# Altium schematic sheet Connectors.SchDoc
size A4; SheetNumber: 10; SheetTotal: 11
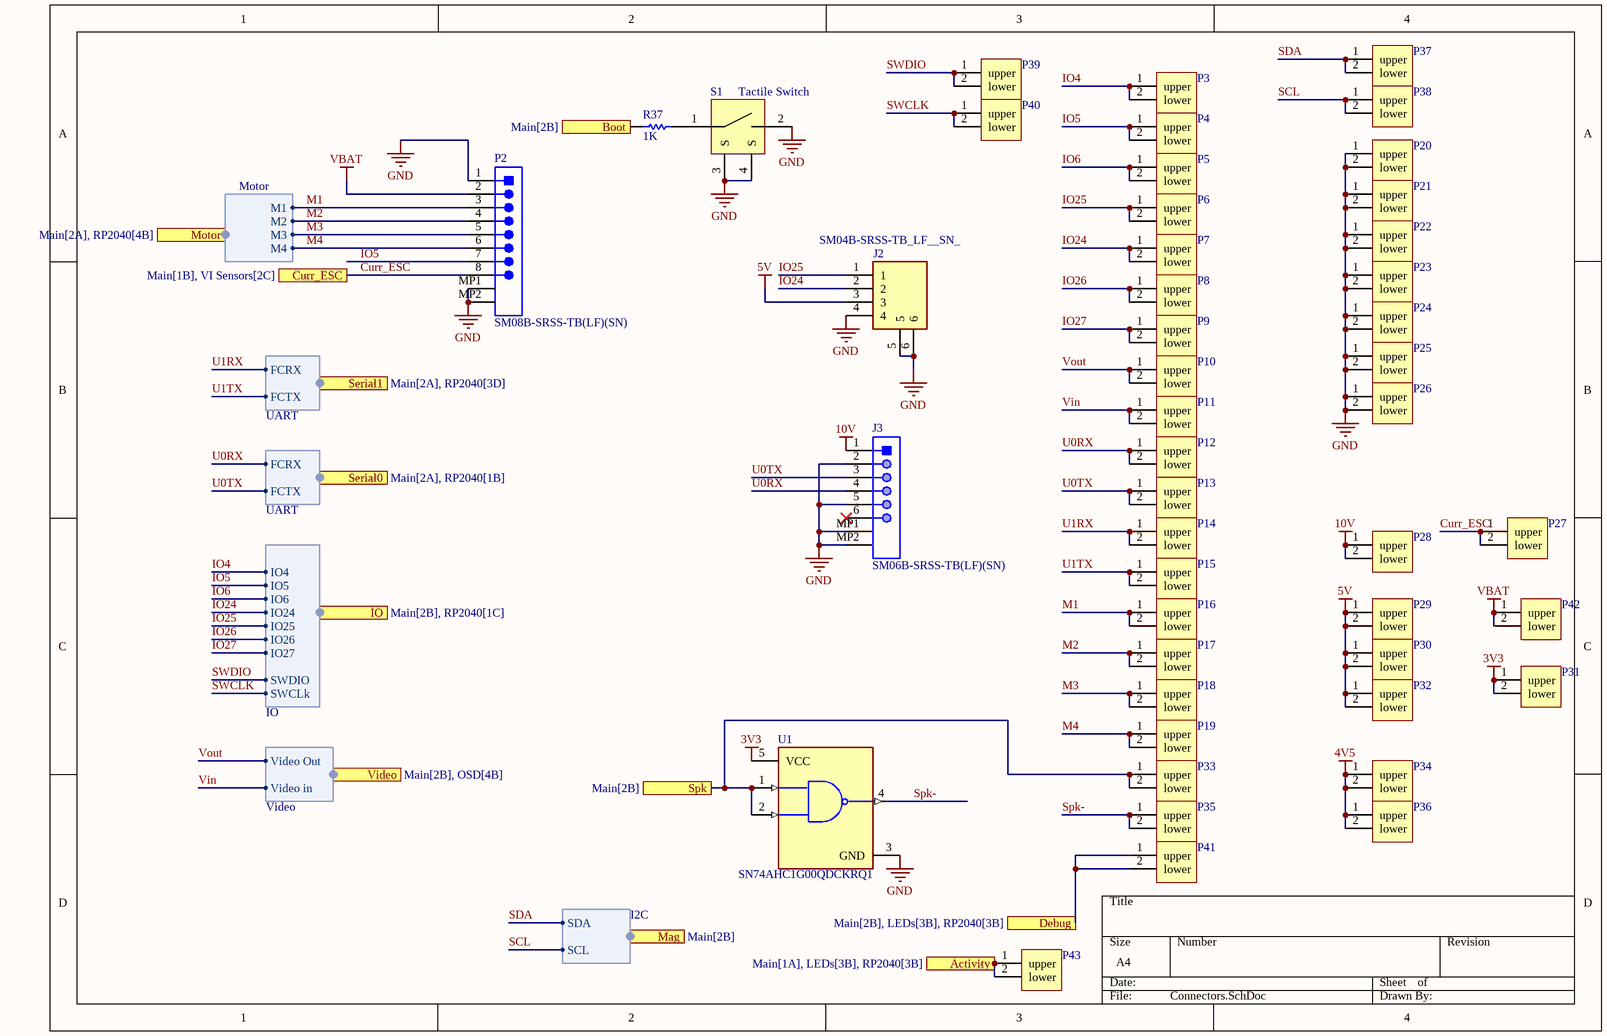
[diagram p0: Connectors.SchDoc]

## Parts
J2  SM04B-SRSS-TB_LF__SN_  [SM04B-SRSS-TB(LFSN)]
J3  SM06B-SRSS-TB(LF)(SN)  [JST-SM06B-SRSS-TB_V]
P2  SM08B-SRSS-TB(LF)(SN)  [JST-SM08B-SRSS-TB_V]
P3  solder pad rounded double sided  [solder pad double sided rounded - duplicate]  (value not drawn)
P4  solder pad rounded double sided  [solder pad double sided rounded - duplicate]  (value not drawn)
P5  solder pad rounded double sided  [solder pad double sided rounded - duplicate]  (value not drawn)
P6  solder pad rounded double sided  [solder pad double sided rounded - duplicate]  (value not drawn)
P7  solder pad rounded double sided  [solder pad double sided rounded - duplicate]  (value not drawn)
P8  solder pad rounded double sided  [solder pad double sided rounded - duplicate]  (value not drawn)
P9  solder pad rounded double sided  [solder pad double sided rounded - duplicate]  (value not drawn)
P10  solder pad rounded double sided  [solder pad double sided rounded - duplicate]  (value not drawn)
P11  solder pad rounded double sided  [solder pad double sided rounded - duplicate]  (value not drawn)
P12  solder pad rounded double sided  [solder pad double sided rounded - duplicate]  (value not drawn)
P13  solder pad rounded double sided  [solder pad double sided rounded - duplicate]  (value not drawn)
P14  solder pad rounded double sided  [solder pad double sided rounded - duplicate]  (value not drawn)
P15  solder pad rounded double sided  [solder pad double sided rounded - duplicate]  (value not drawn)
P16  solder pad rounded double sided  [solder pad double sided rounded - duplicate]  (value not drawn)
P17  solder pad rounded double sided  [solder pad double sided rounded - duplicate]  (value not drawn)
P18  solder pad rounded double sided  [solder pad double sided rounded - duplicate]  (value not drawn)
P19  solder pad rounded double sided  [solder pad double sided rounded - duplicate]  (value not drawn)
P20  solder pad square double sided  [solder pad double sided square]  (value not drawn)
P21  solder pad square double sided  [solder pad double sided square]  (value not drawn)
P22  solder pad square double sided  [solder pad double sided square]  (value not drawn)
P23  solder pad square double sided  [solder pad double sided square]  (value not drawn)
P24  solder pad square double sided  [solder pad double sided square]  (value not drawn)
P25  solder pad square double sided  [solder pad double sided square]  (value not drawn)
P26  solder pad square double sided  [solder pad double sided square]  (value not drawn)
P27  solder pad chamfered double sided  [solder pad double sided chamfered]  (value not drawn)
P28  solder pad chamfered double sided  [solder pad double sided chamfered]  (value not drawn)
P29  solder pad chamfered double sided  [solder pad double sided chamfered]  (value not drawn)
P30  solder pad chamfered double sided  [solder pad double sided chamfered]  (value not drawn)
P31  solder pad chamfered double sided  [solder pad double sided chamfered]  (value not drawn)
P32  solder pad chamfered double sided  [solder pad double sided chamfered]  (value not drawn)
P33  solder pad rounded double sided  [solder pad double sided rounded - duplicate]  (value not drawn)
P34  solder pad chamfered double sided  [solder pad double sided chamfered]  (value not drawn)
P35  solder pad rounded double sided  [solder pad double sided rounded - duplicate]  (value not drawn)
P36  solder pad chamfered double sided  [solder pad double sided chamfered]  (value not drawn)
P37  solder pad rounded double sided  [solder pad double sided rounded - duplicate]  (value not drawn)
P38  solder pad rounded double sided  [solder pad double sided rounded - duplicate]  (value not drawn)
P39  solder pad rounded double sided  [solder pad double sided rounded - duplicate]  (value not drawn)
P40  solder pad rounded double sided  [solder pad double sided rounded - duplicate]  (value not drawn)
P41  solder pad rounded double sided  [solder pad double sided rounded - duplicate]  (value not drawn)
P42  solder pad chamfered double sided  [solder pad double sided chamfered]  (value not drawn)
P43  solder pad rounded double sided  [solder pad double sided rounded - duplicate]  (value not drawn)
R37  1K  [RESC0603(1608)_N]
S1  Tactile Switch  [Tactile Switch]
U1  SN74AHC1G00QDCKRQ1  [FP-DCK0005A-IPC_A]

## Ports
Activity (see Main[1A], LEDs[3B], RP2040[3B]), Boot (see Main[2B]), Curr_ESC (see Main[1B], VI Sensors[2C]), Debug (see Main[2B], LEDs[3B], RP2040[3B]), IO (harness IO, see Main[2B], RP2040[1C]), Mag (harness I2C, see Main[2B]), Motor (harness Motor, see Main[2A], RP2040[4B]), Serial0 (harness UART, see Main[2A], RP2040[1B]), Serial1 (harness UART, see Main[2A], RP2040[3D]), Spk (see Main[2B]), Video (harness Video, see Main[2B], OSD[4B])

## Harnesses
Motor: M1, M2, M3, M4
UART: FCRX, FCTX
IO: IO4, IO5, IO6, IO24, IO25, IO26, IO27, SWDIO, SWCLk
Video: Video Out, Video in
I2C: SDA, SCL

## Nets
3V3: P31.1(upper) P31.2(lower) U1.5(VCC)
4V5: P34.1(upper) P34.2(lower) P36.1(upper) P36.2(lower)
5V: J2.3 P29.1(upper) P29.2(lower) P30.1(upper) P30.2(lower) P32.1(upper) P32.2(lower)
10V: J3.1 P28.1(upper) P28.2(lower)
GND: J2.4 J2.5 J2.6 J3.2 J3.5 J3.MP1 J3.MP2 P2.1 P2.MP1 P2.MP2 P20.1(upper) P20.2(lower) P21.1(upper) P21.2(lower) P22.1(upper) P22.2(lower) P23.1(upper) P23.2(lower) P24.1(upper) P24.2(lower) P25.1(upper) P25.2(lower) P26.1(upper) P26.2(lower) S1.2 S1.3(S) S1.4(S) U1.3(GND)
VBAT: P2.2 P42.1(upper) P42.2(lower)
Activity: P43.1(upper) P43.2(lower) ; port Activity
Boot: R37.1 ; port Boot
Curr_ESC: P2.8 P27.1(upper) P27.2(lower) ; port Curr_ESC
Debug: P41.1(upper) P41.2(lower) ; port Debug
IO4: P3.1(upper) P3.2(lower) ; port IO.IO4
IO5: P2.7 P4.1(upper) P4.2(lower) ; port IO.IO5
IO6: P5.1(upper) P5.2(lower) ; port IO.IO6
IO24: J2.2 P7.1(upper) P7.2(lower) ; port IO.IO24
IO25: J2.1 P6.1(upper) P6.2(lower) ; port IO.IO25
IO26: P8.1(upper) P8.2(lower) ; port IO.IO26
IO27: P9.1(upper) P9.2(lower) ; port IO.IO27
M1: P2.3 P16.1(upper) P16.2(lower) ; port Motor.M1
M2: P2.4 P17.1(upper) P17.2(lower) ; port Motor.M2
M3: P2.5 P18.1(upper) P18.2(lower) ; port Motor.M3
M4: P2.6 P19.1(upper) P19.2(lower) ; port Motor.M4
SCL: P38.1(upper) P38.2(lower) ; port Mag.SCL
SDA: P37.1(upper) P37.2(lower) ; port Mag.SDA
Spk: P33.1(upper) P33.2(lower) U1.1(A) U1.2(B) ; port Spk
Spk-: P35.1(upper) P35.2(lower) U1.4(Y)
SWCLK: P40.1(upper) P40.2(lower) ; port IO.SWCLk
SWDIO: P39.1(upper) P39.2(lower) ; port IO.SWDIO
U0RX: J3.4 P12.1(upper) P12.2(lower) ; port Serial0.FCRX
U0TX: J3.3 P13.1(upper) P13.2(lower) ; port Serial0.FCTX
U1RX: P14.1(upper) P14.2(lower) ; port Serial1.FCRX
U1TX: P15.1(upper) P15.2(lower) ; port Serial1.FCTX
Vin: P11.1(upper) P11.2(lower) ; port Video.Video in
Vout: P10.1(upper) P10.2(lower) ; port Video.Video Out
NetR37_2: R37.2 S1.1

Not connected (* = marked no-connect by the designer): J3 6*

## Library data of the parts
J2 = SM04B-SRSS-TB_LF__SN_: Connector; Manufacturer_Name: JST (JAPAN SOLDERLESS TERMINALS); Manufacturer_Part_Number: SM04B-SRSS-TB(LF)(SN); Datasheet Link: http://www.jst-mfg.com/product/pdf/eng/eSH.pdf; Arrow Part Number: SM04B-SRSS-TB(LF)(SN); Arrow Price/Stock: https://www.arrow.com/en/products/sm04b-srss-tb-lf-sn/jst-manufacturing?region=europe
J3 = CMP-2000-07080-1: Male Header, Pitch 1 mm, 1 x 6 Position, Height 2.95 mm, -25 to 85 degC, RoHS, Tape and Reel; Manufacturer: JST; No of Positions: 6; Pitch: 1mm; Style/Orientation: RightAngleHeader/Plug; Datasheet URL: https://datasheet.ciiva.com/26894/getdatasheetpartid-708885-26894671.pdf; Package Description: Male Header, Pitch 1 mm, 1 X 6 Position, Height 2.9 mm; Termination: Solder; Manufacturer URL: http://www.jst.com/home2.html; Type: ShroudedHeader; Package Reference: SM06B-SRSS-TB; Datasheet Version: 11/2010; Mounting Technology: SurfaceMount
P2 = CMP-2000-07082-1: Male Header, Pitch 1 mm, 1 x 8 Position, Height 2.95 mm, -25 to 85 degC, RoHS, Tape and Reel; Manufacturer: JST; Style/Orientation: RightAngleHeader/Plug; Pitch: 1mm; No of Positions: 8; Manufacturer URL: http://www.jst.com/home2.html; Mounting Technology: SurfaceMount; Package Description: Male Header, Pitch 1 mm, 1 x 8 Position, Height 2.95 mm; Datasheet URL: http://www.jst-mfg.com/product/pdf/eng/eSR.pdf; Type: ShroudedHeader; Termination: Crimp; Package Reference: SM08B-SRSS-TB; Datasheet Version: 11/2010
R37 = Res 1K: Chipwiderstand, SMD, Baureihe MC, 1%; Manufacturer: Multicomp; PackageReference: 0603; Value: 1K; OC_FARNELL: 9330380
U1 = CMP-0859-00415-4: IC GATE NAND 1CH 2-INP SC70-5; Number of Output Lines: 1; Max Supply Voltage: 5.5V; High Level Output Current: -8mA; Propagation Delay: 7.5ns; Min Supply Voltage: 2V; Logic Function: NAND GATE; Low Level Output Current: 8mA; Number of Inputs: 2; Quiescent Current: 1uA; Lead Free: Lead Free; Series: 74AHC; Number of Pins: 5; Number of Gates: 1; Max Operating Temperature: 125°C; Number of Elements: 1; Case/Package: SC; Packaging: Tape and Reel; Technology: CMOS; Radiation Hardening: No; Min Operating Temperature: -40°C; Output Current: 8mA; Mount: Surface Mount; Number of Bits: 1; RoHS Compliant: Yes; Number of Circuits: 1; Number of Input Lines: 2; Package Quantity: 1; Number of Outputs: 1